# Altium schematic sheet 03_RS485.SchDoc: RS485 Interfaces
size A4; SheetNumber: 4; SheetTotal: 7; Project_Name: Monitoring_Control_Circuit; Designer: Hao Thai; Version: 1.0
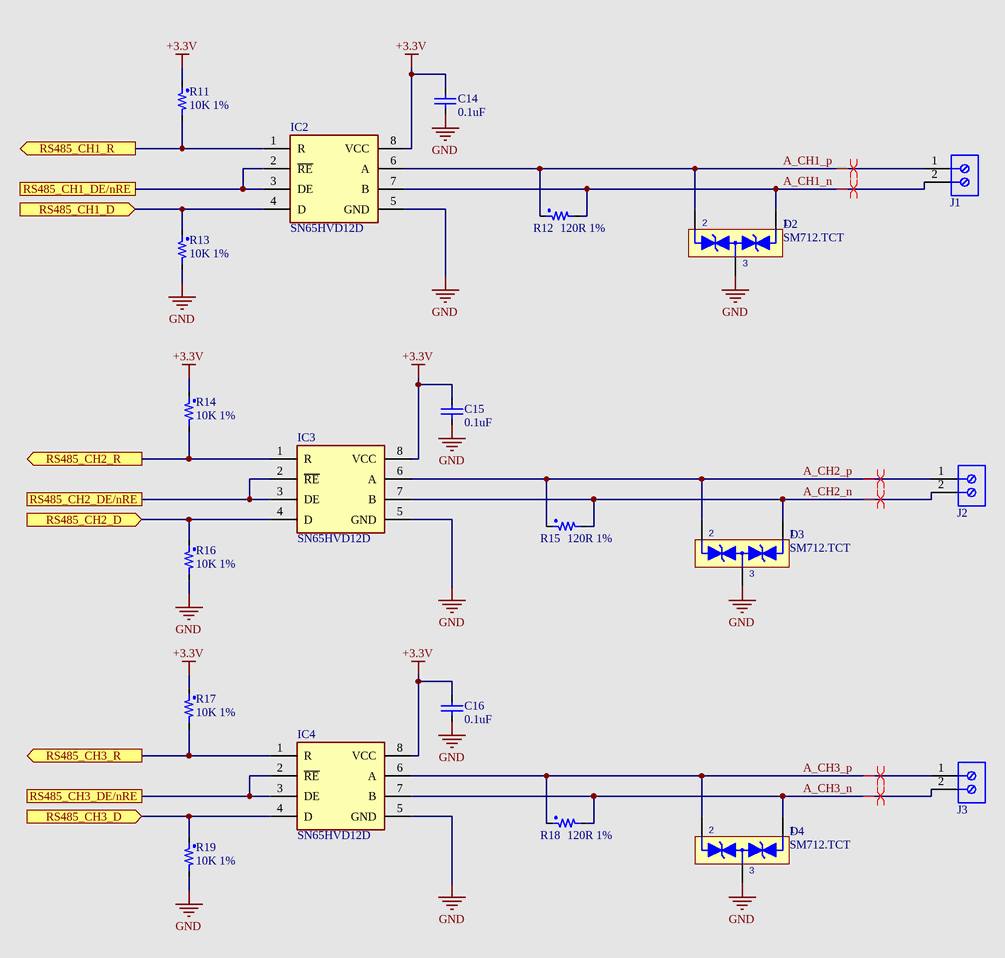
[diagram p0: 03_RS485.SchDoc]

## Parts
C14  0.1uF  [C0603 (1608 metric)]
C15  0.1uF  [C0603 (1608 metric)]
C16  0.1uF  [C0603 (1608 metric)]
D2  SM712.TCT  [SM712]
D3  SM712.TCT  [SM712]
D4  SM712.TCT  [SM712]
IC2  SN65HVD12D  [SOIC8]
IC3  SN65HVD12D  [SOIC8]
IC4  SN65HVD12D  [SOIC8]
J1  691103110002  [691103110002]  (value not drawn)
J2  691103110002  [691103110002]  (value not drawn)
J3  691103110002  [691103110002]  (value not drawn)
R11  10K 1%  [R0603 (1608 Metric)]
R12  120R 1%  [R0805 (2012 METRIC)]
R13  10K 1%  [R0603 (1608 Metric)]
R14  10K 1%  [R0603 (1608 Metric)]
R15  120R 1%  [R0805 (2012 METRIC)]
R16  10K 1%  [R0603 (1608 Metric)]
R17  10K 1%  [R0603 (1608 Metric)]
R18  120R 1%  [R0805 (2012 METRIC)]
R19  10K 1%  [R0603 (1608 Metric)]

## Ports
RS485_CH1_D (in), RS485_CH1_DE/nRE, RS485_CH1_R (out), RS485_CH2_D (in), RS485_CH2_DE/nRE, RS485_CH2_R (out), RS485_CH3_D (in), RS485_CH3_DE/nRE, RS485_CH3_R (out)

## Nets
+3.3V: C14.1 C15.1 C16.1 IC2.8(VCC) IC3.8(VCC) IC4.8(VCC) R11.1 R14.1 R17.1
GND: C14.2 C15.2 C16.2 D2.3(GND) D3.3(GND) D4.3(GND) IC2.5(GND) IC3.5(GND) IC4.5(GND) R13.2 R16.2 R19.2
A_CH1_n: D2.1(I/O1) IC2.7(B) J1.2 R12.2
A_CH1_p: D2.2(I/O2) IC2.6(A) J1.1 R12.1
A_CH2_n: D3.1(I/O1) IC3.7(B) J2.2 R15.2
A_CH2_p: D3.2(I/O2) IC3.6(A) J2.1 R15.1
A_CH3_n: D4.1(I/O1) IC4.7(B) J3.2 R18.2
A_CH3_p: D4.2(I/O2) IC4.6(A) J3.1 R18.1
RS485_CH1_D: IC2.4(D) R13.1 ; port RS485_CH1_D
RS485_CH1_DE/nRE: IC2.2(~{RE}) IC2.3(DE) ; port RS485_CH1_DE/nRE
RS485_CH1_R: IC2.1(R) R11.2 ; port RS485_CH1_R
RS485_CH2_D: IC3.4(D) R16.1 ; port RS485_CH2_D
RS485_CH2_DE/nRE: IC3.2(~{RE}) IC3.3(DE) ; port RS485_CH2_DE/nRE
RS485_CH2_R: IC3.1(R) R14.2 ; port RS485_CH2_R
RS485_CH3_D: IC4.4(D) R19.1 ; port RS485_CH3_D
RS485_CH3_DE/nRE: IC4.2(~{RE}) IC4.3(DE) ; port RS485_CH3_DE/nRE
RS485_CH3_R: IC4.1(R) R17.2 ; port RS485_CH3_R

## Layout directives
differential pair: A_CH1_n, A_CH1_p, A_CH2_n, A_CH2_p, A_CH3_n, A_CH3_p

## Notes on the sheet
- Document Title:
- BK Maker Club
- Size:
- Project Name:
- A4
- Designer:
- Reviewer:
- Revision:
- Sheet
- of
- Nguyen Xien Street
- Long Thanh My Ward, Thu Duc District
- Ho Chi Minh City
- Date:
- File:

## Library data of the parts
C14-C16 = CC0603KRX7R9BB104: Multilayer Ceramic Capacitors MLCC - SMD/SMT 0.1uF 50V X7R +/-10% 0603; Mfr: Yageo; Tolerance: 10%; Mfr Part Number: CC0603KRX7R9BB104; Supplier Part Number 1: 603-CC603KRX7R9BB104; Supplier 1: Mouser; Value: 0.1uF; Dielectric: X7R; Case: 0603 (1608 metric); Voltage: 50V
D2-D4 = SM712.TCT: ESD Suppressors / TVS Diodes 400W ASYMMETRICAL TVS 7V,12V; Mfr: SEMTECH; Datasheet Link: https://datasheet.datasheetarchive.com/originals/distributors/Datasheets-30/DSA-588511.pdf; Height: 1.12mm; Mfr Part Number: SM712.TCT; Supplier Part Number 1: 947-SM712.TCT; Supplier 1: Mouser; Arrow Part Number: SM712.TCT; Arrow Price/Stock: https://www.arrow.com/en/products/sm712.tct/semtech?region=nac
IC2-IC4 = SN65HVD12D: RS-485 Interface IC 3.3V Differential Transceivers; Mfr: Texas Instruments; Mfr Part Number: SN65HVD12DR; Height: 1.75mm; Supplier Part Number 1: 595-SN65HVD12DR; Supplier 1: Mouser
J1-J3 = 691103110002: WR-TBL Series 1031 Horizontal Entry Modular, THT, pitch 3.5mm, 2p; Mfr: Wurth Elektronik; Modularity: Yes; Rated Current: 10A; Working Voltage: 125V; ComponentLink1Description: Website Link; ComponentLink1URL: https://www.we-online.com/redexpert/article/691103110002?ad; ComponentLink2Description: Datasheet Link; ComponentLink2URL: https://www.we-online.com/redexpert/spec/691103110002?ad; Mfr Part Number: 691103110002; Category: Terminal Blocks; Match Code: WR-TBL; Mount: Through Hole; Operating Temperature Max: 105°C; Operating Temperature Min: -40°C; Packaging: Box; Application: Pressure Clamp; Number of Pins: 2; Number of Rows: 1; Orientation: Horizontal; Pitch: 3.5mm
R11 R13 R14 R16 R17 R19 = RC0603FR-0710KL: Thick Film Resistors - SMD 10K OHM 1% Case 0603; Mfr: Yageo; Value: 10K; Supplier 1: Mouser; Supplier Part Number 1: 603-RC0603FR-0710KL; Mfr Part Number: RC0603FR-0710KL; Case: 0603 (1608 metric); Tolerance: 1%
R12 R15 R18 = RC0805FR-07120RL: Thick Film Resistors - SMD 120 OHM 1%; Mfr: Yageo; Value: 120R; Supplier 1: Mouser; Supplier Part Number 1: 603-RC0805FR-07120RL; Mfr Part Number: RC0805FR-07120RL; Case: 0805 (2012 metric); Tolerance: 1%